# Altium schematic sheet Hack_Final.SchDoc
size A2; SheetNumber: 1; SheetTotal: 2
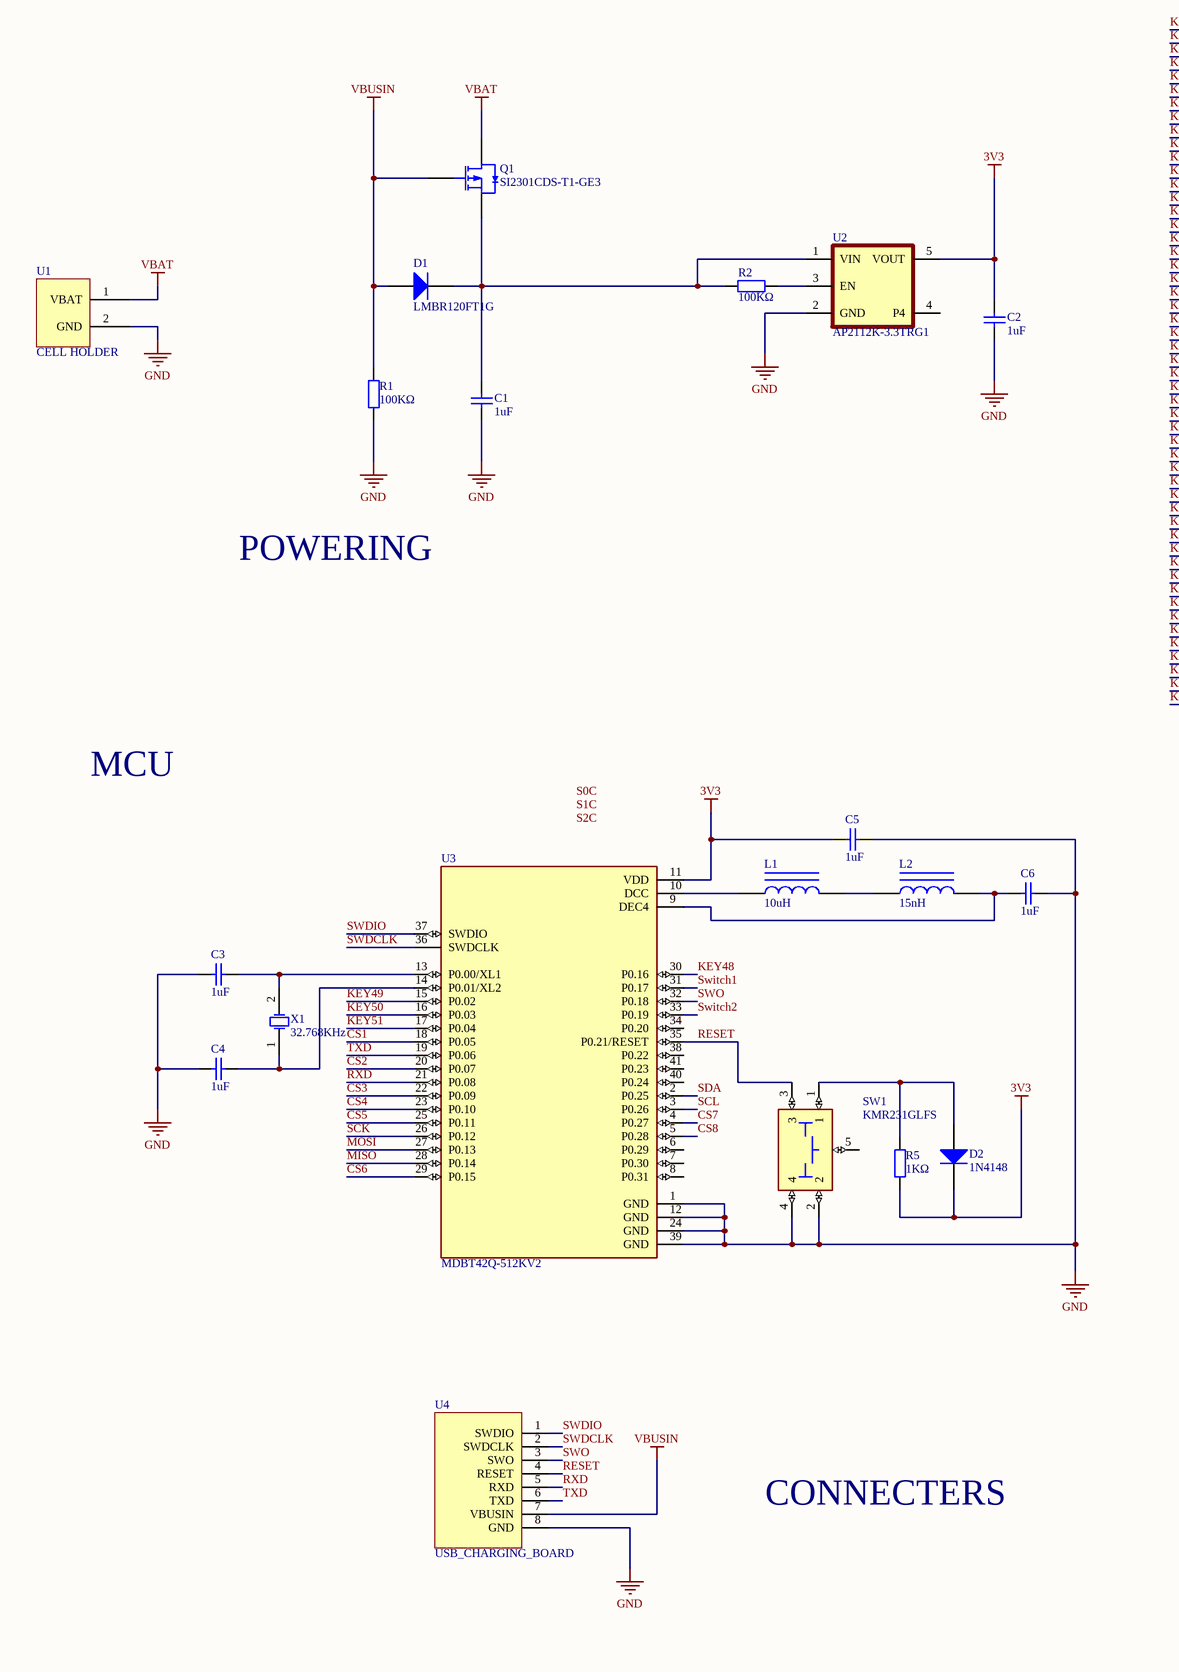
[diagram p0: Hack_Final.SchDoc, left]
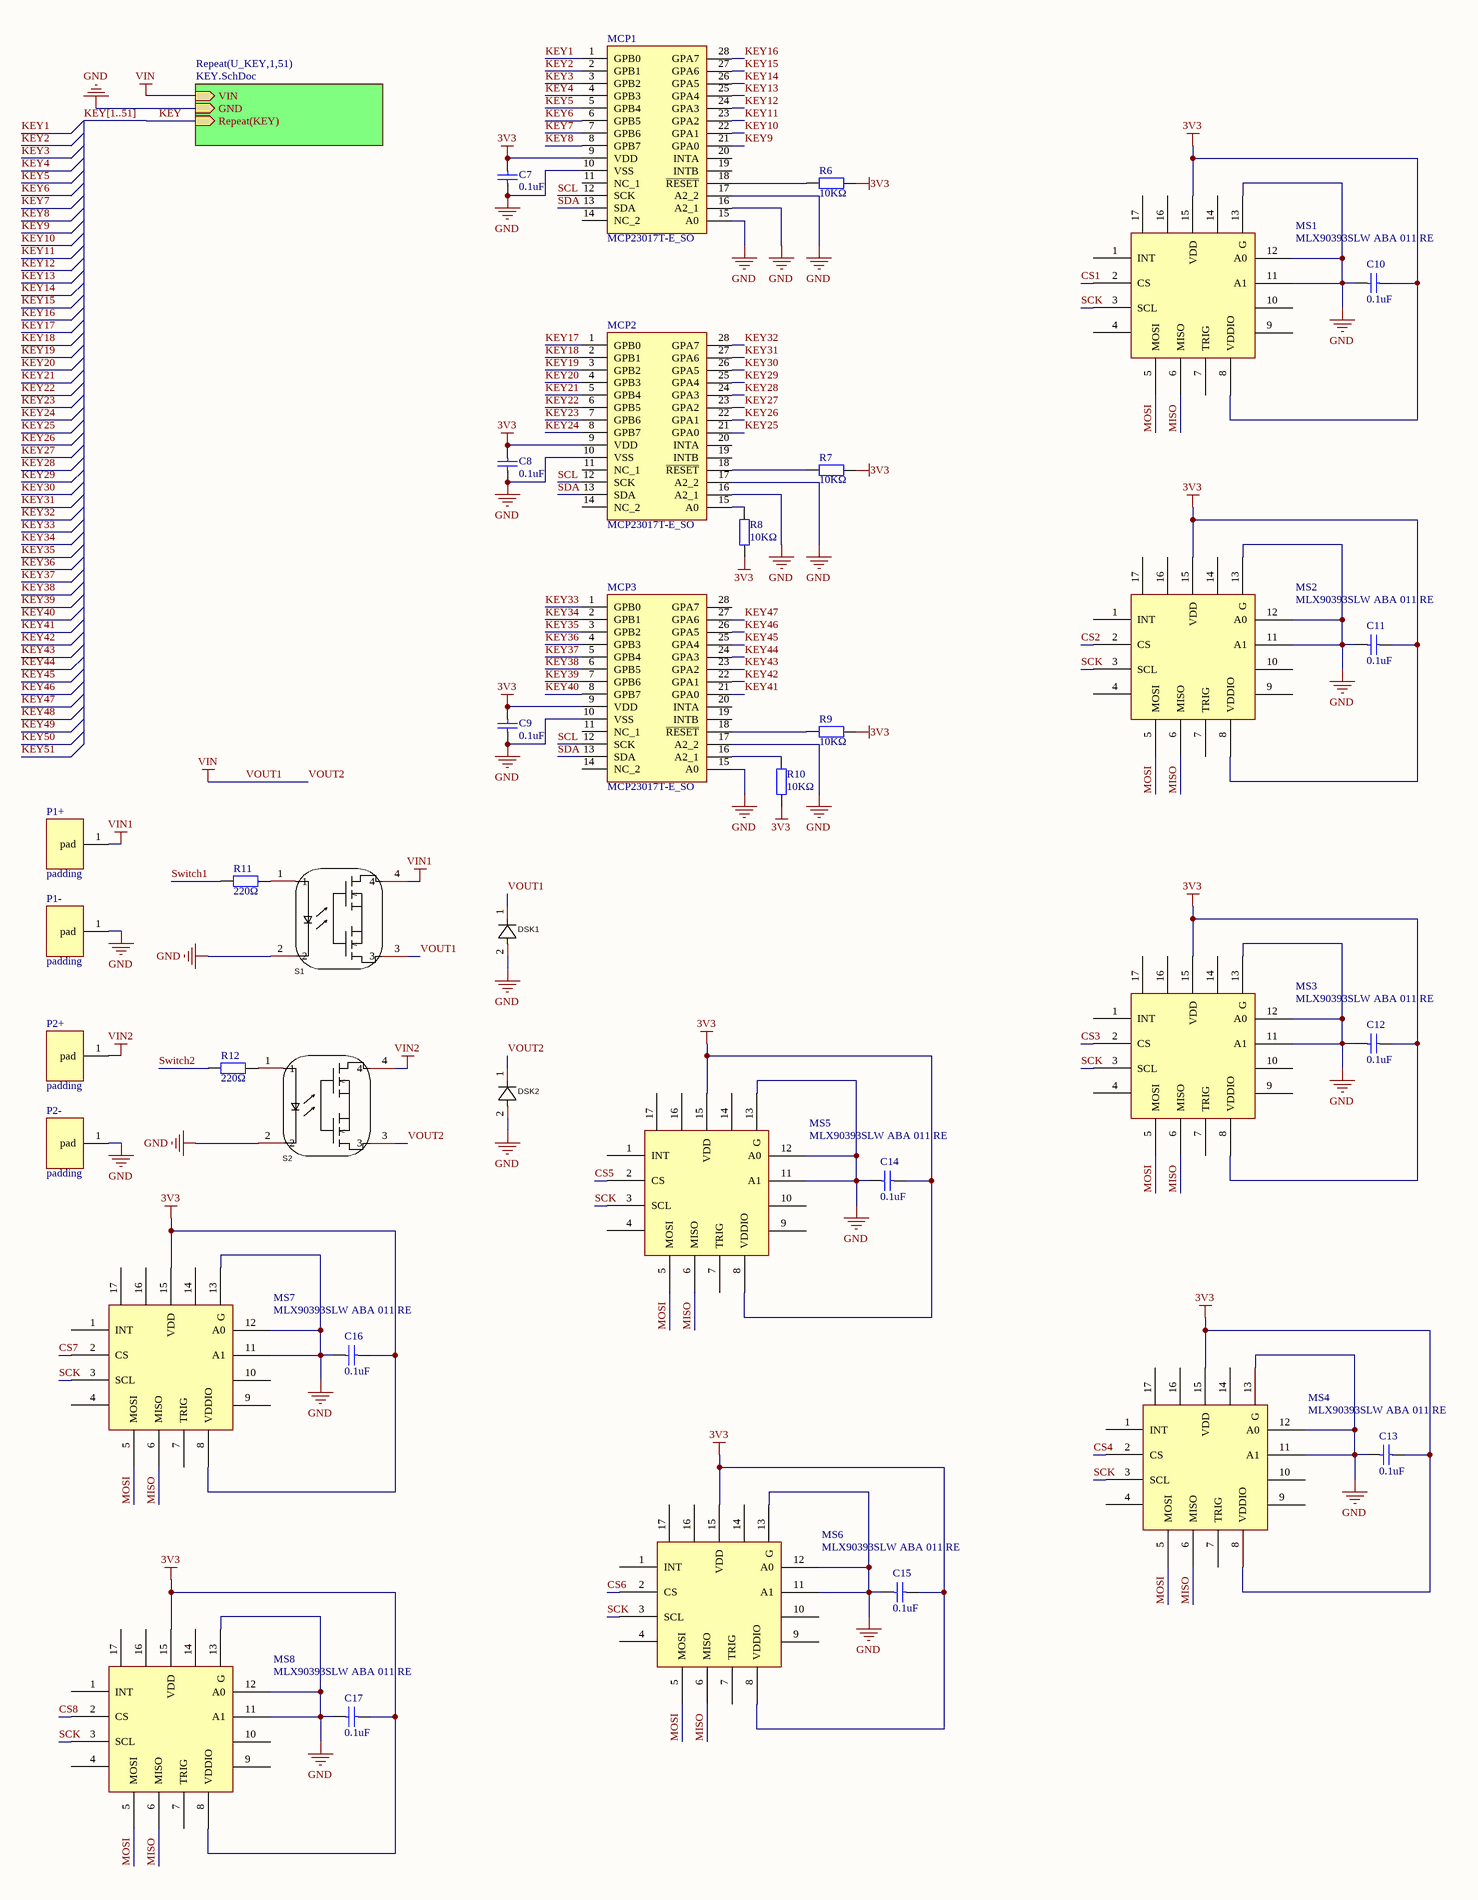
[diagram p1: Hack_Final.SchDoc, right]

## Parts
C1  1uF  [0603_C]
C2  1uF  [0603_C]
C3  1uF  [0603_C]
C4  1uF  [0603_C]
C5  1uF  [0603_C]
C6  1uF  [0603_C]
C7  0.1uF  [0603_C]
C8  0.1uF  [0603_C]
C9  0.1uF  [0603_C]
C10  0.1uF  [0603_C]
C11  0.1uF  [0603_C]
C12  0.1uF  [0603_C]
C13  0.1uF  [0603_C]
C14  0.1uF  [0603_C]
C15  0.1uF  [0603_C]
C16  0.1uF  [0603_C]
C17  0.1uF  [0603_C]
D1  LMBR120FT1G  [SOD-123]
D2  1N4148  [SOD-323F]
DSK1  DSK16  [DSK16]  (value not drawn)
DSK2  DSK16  [DSK16]  (value not drawn)
L1  10uH  [0402_L]
L2  15nH  [0402_L]
MCP1  MCP23017T-E_SO  [SOIC127P1030X265-28N]
MCP2  MCP23017T-E_SO  [SOIC127P1030X265-28N]
MCP3  MCP23017T-E_SO  [SOIC127P1030X265-28N]
MS1  MLX90393SLW ABA 011 RE  [VQFN-16_EP_3.0x3.0xo.5P]
MS2  MLX90393SLW ABA 011 RE  [VQFN-16_EP_3.0x3.0xo.5P]
MS3  MLX90393SLW ABA 011 RE  [VQFN-16_EP_3.0x3.0xo.5P]
MS4  MLX90393SLW ABA 011 RE  [VQFN-16_EP_3.0x3.0xo.5P]
MS5  MLX90393SLW ABA 011 RE  [VQFN-16_EP_3.0x3.0xo.5P]
MS6  MLX90393SLW ABA 011 RE  [VQFN-16_EP_3.0x3.0xo.5P]
MS7  MLX90393SLW ABA 011 RE  [VQFN-16_EP_3.0x3.0xo.5P]
MS8  MLX90393SLW ABA 011 RE  [VQFN-16_EP_3.0x3.0xo.5P]
P1+  padding  [PADDING2]
P1-  padding  [PADDING2]
P2+  padding  [PADDING2]
P2-  padding  [PADDING2]
Q1  SI2301CDS-T1-GE3  [SOT-23(SOT-23-3)]
R1  100KΩ  [0603_R]
R2  100KΩ  [0603_R]
R5  1KΩ  [0603_R]
R6  10KΩ  [0603_R]
R7  10KΩ  [0603_R]
R8  10KΩ  [0603_R]
R9  10KΩ  [0603_R]
R10  10KΩ  [0603_R]
R11  220Ω  [0603_R]
R12  220Ω  [0603_R]
S1  GAQY212GSX  [SOP-4_L4.3-W4.4-P2.54-LS6.8-TR]  (value not drawn)
S2  GAQY212GSX  [SOP-4_L4.3-W4.4-P2.54-LS6.8-TR]  (value not drawn)
SW1  KMR231GLFS  [KMR231GLFS]
U1  CELL HOLDER  [BAT_MX 1.25-WI-2P]
U2  AP2112K-3.3TRG1  [SOT95P285X140-5N]
U3  MDBT42Q-512KV2  [SMD_10.0X16.0]
U4  USB_CHARGING_BOARD  [FPC0.5 2H-WS-8P]
X1  32.768KHz  [SMD-3215_2P FC - 135]

## Sub-sheets
Repeat(U_KEY,1,51) = KEY.SchDoc: VIN (in), GND (in), Repeat(KEY) (in)

## Nets
3V3: C2.2 C5.2 C7.1 C8.1 C9.1 C10.2 C11.2 C12.2 C13.2 C14.2 C15.2 C16.2 C17.2 D2.2(K) MCP1.9(VDD) MCP2.9(VDD) MCP3.9(VDD) MS1.8(VDDIO) MS1.15(VDD) MS2.8(VDDIO) MS2.15(VDD) MS3.8(VDDIO) MS3.15(VDD) MS4.8(VDDIO) MS4.15(VDD) MS5.8(VDDIO) MS5.15(VDD) MS6.8(VDDIO) MS6.15(VDD) MS7.8(VDDIO) MS7.15(VDD) MS8.8(VDDIO) MS8.15(VDD) R5.2 R6.1 R7.1 R8.2 R9.1 R10.2 U2.5(VOUT) U3.11(VDD)
GND: C1.1 C2.1 C3.2 C4.2 C5.1 C6.1 C7.2 C8.2 C9.2 C10.1 C11.1 C12.1 C13.1 C14.1 C15.1 C16.1 C17.1 DSK1.2(A) DSK2.2(A) MCP1.10(VSS) MCP1.15(A0) MCP1.16(A2_1) MCP1.17(A2_2) MCP2.10(VSS) MCP2.16(A2_1) MCP2.17(A2_2) MCP3.10(VSS) MCP3.15(A0) MCP3.17(A2_2) MS1.11(A1) MS1.12(A0) MS1.13(G) MS2.11(A1) MS2.12(A0) MS2.13(G) MS3.11(A1) MS3.12(A0) MS3.13(G) MS4.11(A1) MS4.12(A0) MS4.13(G) MS5.11(A1) MS5.12(A0) MS5.13(G) MS6.11(A1) MS6.12(A0) MS6.13(G) MS7.11(A1) MS7.12(A0) MS7.13(G) MS8.11(A1) MS8.12(A0) MS8.13(G) P1-.1(pad) P2-.1(pad) R1.1 S1.2 S2.2 SW1.2 SW1.4 U1.2(GND) U2.2(GND) U3.1(GND) U3.12(GND) U3.24(GND) U3.39(GND) U4.8(GND) ; sheet Repeat(U_KEY,1,51)/GND
VBAT: Q1.3(D) U1.1(VBAT)
VBUSIN: D1.1(A) Q1.1(G) R1.2 U4.7(VBUSIN)
VIN1: P1+.1(pad) S1.4
VIN2: P2+.1(pad) S2.4
VOUT1: DSK1.1(K) DSK2.1(K) S1.3 S2.3 ; sheet Repeat(U_KEY,1,51)/VIN  [also labelled VIN, VOUT2]
CS1: MS1.2(CS) U3.18(P0.05)
CS2: MS2.2(CS) U3.20(P0.07)
CS3: MS3.2(CS) U3.22(P0.09)
CS4: MS4.2(CS) U3.23(P0.10)
CS5: MS5.2(CS) U3.25(P0.11)
CS6: MS6.2(CS) U3.29(P0.15)
CS7: MS7.2(CS) U3.4(P0.27)
CS8: MS8.2(CS) U3.5(P0.28)
KEY: sheet Repeat(U_KEY,1,51)/Repeat(KEY)
KEY1: MCP1.1(GPB0)
KEY2: MCP1.2(GPB1)
KEY3: MCP1.3(GPB2)
KEY4: MCP1.4(GPB3)
KEY5: MCP1.5(GPB4)
KEY6: MCP1.6(GPB5)
KEY7: MCP1.7(GPB6)
KEY8: MCP1.8(GPB7)
KEY9: MCP1.21(GPA0)
KEY10: MCP1.22(GPA1)
KEY11: MCP1.23(GPA2)
KEY12: MCP1.24(GPA3)
KEY13: MCP1.25(GPA4)
KEY14: MCP1.26(GPA5)
KEY15: MCP1.27(GPA6)
KEY16: MCP1.28(GPA7)
KEY17: MCP2.1(GPB0)
KEY18: MCP2.2(GPB1)
KEY19: MCP2.3(GPB2)
KEY20: MCP2.4(GPB3)
KEY21: MCP2.5(GPB4)
KEY22: MCP2.6(GPB5)
KEY23: MCP2.7(GPB6)
KEY24: MCP2.8(GPB7)
KEY25: MCP2.21(GPA0)
KEY26: MCP2.22(GPA1)
KEY27: MCP2.23(GPA2)
KEY28: MCP2.24(GPA3)
KEY29: MCP2.25(GPA4)
KEY30: MCP2.26(GPA5)
KEY31: MCP2.27(GPA6)
KEY32: MCP2.28(GPA7)
KEY33: MCP3.1(GPB0)
KEY34: MCP3.2(GPB1)
KEY35: MCP3.3(GPB2)
KEY36: MCP3.4(GPB3)
KEY37: MCP3.5(GPB4)
KEY38: MCP3.6(GPB5)
KEY39: MCP3.7(GPB6)
KEY40: MCP3.8(GPB7)
KEY41: MCP3.21(GPA0)
KEY42: MCP3.22(GPA1)
KEY43: MCP3.23(GPA2)
KEY44: MCP3.24(GPA3)
KEY45: MCP3.25(GPA4)
KEY46: MCP3.26(GPA5)
KEY47: MCP3.27(GPA6)
KEY48: U3.30(P0.16)
KEY49: U3.15(P0.02)
KEY50: U3.16(P0.03)
KEY51: U3.17(P0.04)
MISO: MS1.6(MISO) MS2.6(MISO) MS3.6(MISO) MS4.6(MISO) MS5.6(MISO) MS6.6(MISO) MS7.6(MISO) MS8.6(MISO) U3.28(P0.14)
MOSI: MS1.5(MOSI) MS2.5(MOSI) MS3.5(MOSI) MS4.5(MOSI) MS5.5(MOSI) MS6.5(MOSI) MS7.5(MOSI) MS8.5(MOSI) U3.27(P0.13)
RESET: SW1.3 U3.35(P0.21/RESET) U4.4(RESET)
RXD: U3.21(P0.08) U4.5(RXD)
SCK: MS1.3(SCL) MS2.3(SCL) MS3.3(SCL) MS4.3(SCL) MS5.3(SCL) MS6.3(SCL) MS7.3(SCL) MS8.3(SCL) U3.26(P0.12)
SCL: MCP1.12(SCK) MCP2.12(SCK) MCP3.12(SCK) U3.3(P0.26)
SDA: MCP1.13(SDA) MCP2.13(SDA) MCP3.13(SDA) U3.2(P0.25)
SWDCLK: U3.36(SWDCLK) U4.2(SWDCLK)
SWDIO: U3.37(SWDIO) U4.1(SWDIO)
Switch1: R11.1 U3.31(P0.17)
Switch2: R12.1 U3.33(P0.19)
SWO: U3.32(P0.18) U4.3(SWO)
TXD: U3.19(P0.06) U4.6(TXD)
NetC1_2: C1.2 D1.2(K) Q1.2(S) R2.2 U2.1(VIN)
NetC3_1: C3.1 U3.13(P0.00/XL1) X1.2(OSC2)
NetC4_1: C4.1 U3.14(P0.01/XL2) X1.1(OSC1)
NetC6_2: C6.2 L2.2 U3.9(DEC4)
NetD2_1: D2.1(A) R5.1 SW1.1
NetL1_1: L1.1 U3.10(DCC)
NetL1_2: L1.2 L2.1
NetMCP1_18: MCP1.18(~{RESET}) R6.2
NetMCP2_15: MCP2.15(A0) R8.1
NetMCP2_18: MCP2.18(~{RESET}) R7.2
NetMCP3_16: MCP3.16(A2_1) R10.1
NetMCP3_18: MCP3.18(~{RESET}) R9.2
NetR2_1: R2.1 U2.3(EN)
NetR11_2: R11.2 S1.1
NetR12_2: R12.2 S2.1

Not connected (* = marked no-connect by the designer): MCP1 11(NC_1) 14(NC_2) 19(INTB) 20(INTA); MCP2 11(NC_1) 14(NC_2) 19(INTB) 20(INTA); MCP3 11(NC_1) 14(NC_2) 19(INTB) 20(INTA) 28(GPA7); MS1 1(INT) 4 7(TRIG) 9 10 14 16 17; MS2 1(INT) 4 7(TRIG) 9 10 14 16 17; MS3 1(INT) 4 7(TRIG) 9 10 14 16 17; MS4 1(INT) 4 7(TRIG) 9 10 14 16 17; MS5 1(INT) 4 7(TRIG) 9 10 14 16 17; MS6 1(INT) 4 7(TRIG) 9 10 14 16 17; MS7 1(INT) 4 7(TRIG) 9 10 14 16 17; MS8 1(INT) 4 7(TRIG) 9 10 14 16 17; SW1 5; U2 4(P4); U3 6(P0.29) 7(P0.30) 8(P0.31) 34(P0.20) 38(P0.22) 40(P0.24) 41(P0.23)

## Buses and harness runs
bus KEY[1..51]

## Notes on the sheet
- POWERING
- MCU
- CONNECTERS
- Labels drawn without touching a wire or pin: S0C, S1C, S2C

## Library data of the parts
C1-C17 = CAP: capacitance; ComponentLink1Description: 供应商链接; ComponentLink1URL: http://www.szlcsc.com/product/details_16531.html; Package: 0603; Supplier: LC; SuppliersPartNumber: C15849
D1 = DIO_5: schottky diode; ComponentLink1Description: 供应商链接; ComponentLink1URL: http://www.szlcsc.com/product/details_9093.html; Package: SOD-123; Supplier: LC; SuppliersPartNumber: C8598
D2 = DIO_4: diode; ComponentLink1Description: 供应商链接; ComponentLink1URL: http://www.szlcsc.com/product/details_2485.html; Package: SOD-323; Supplier: LC; SuppliersPartNumber: C2128
DSK1 DSK2 = DSK16: Manufacturer: HXY MOSFET(华轩阳电子); Symbol: DSK16_C20611954; Add into BOM: yes; Diode Configuration: 独立式; Forward Voltage (Vf@If): 700mV@1A; Reverse Voltage (Vr): 60V; Average Rectified Current (Io): 1A; Name: DSK16; Device: DSK16_C20611954; LCSC Part Name: 电压:60V 电流:1A; Supplier Part: C20611954; Manufacturer Part: DSK16; Supplier Footprint: SOD-123FL; JLCPCB Part Class: Extended Part; Datasheet: https://atta.szlcsc.com/upload/public/pdf/source/20240126/50FF75CDB1A7B4BD07BEF0250A341C5F.pdf; Supplier: LCSC; Convert to PCB: yes; Reverse Leakage Current (Ir): -
L1 = IND_10uH: inductance; ComponentLink1Description: 供应商链接; ComponentLink1URL: http://www.szlcsc.com/product/details_1398.html; Package: 0805; Supplier: LC; SuppliersPartNumber: C1046
L2 = IND_15nH: inductance; ComponentLink1Description: 供应商链接; ComponentLink1URL: http://www.szlcsc.com/product/details_1398.html; Package: 0805; Supplier: LC; SuppliersPartNumber: C1046
MCP1-MCP3 = MCP23017T-E_SO: Integrated Circuit; Manufacturer_Name: Microchip; Manufacturer_Part_Number: MCP23017T-E/SO; Datasheet Link: http://ww1.microchip.com/downloads/en/DeviceDoc/20001952C.pdf; Height: 2.65mm; Mouser Part Number: 579-MCP23017T-E/SO; Mouser Price/Stock: https://www.mouser.co.uk/ProductDetail/Microchip-Technology/MCP23017T-E-SO?qs=usxtMOJb1RylPfT%252BJtgE3Q%3D%3D; Arrow Part Number: MCP23017T-E/SO; Arrow Price/Stock: https://www.arrow.com/en/products/mcp23017t-eso/microchip-technology?region=nac
MS1-MS8 = MLX90393SLW ABA 011 RE: sensor
P1+ P1- P2+ P2- = padding2
Q1 = MOS: field effect tube; ComponentLink1Description: 供应商链接; ComponentLink1URL: http://www.szlcsc.com/product/details_11030.html; Package: SOT-23(SOT-23-3); Supplier: LC; SuppliersPartNumber: C10487
R1 R2 R5-R12 = RES: resistance; ComponentLink1Description: 供应商链接; ComponentLink1URL: http://www.szlcsc.com/product/details_26562.html; Package: 0603; Supplier: LC; SuppliersPartNumber: C25819
S1 S2 = GAQY212GSX: Manufacturer: SUPSiC(国晶微半导体); Add into BOM: yes; Relay Contact Form: 1 Form A (SPST-NO); Load Type: AC,DC; Input Forward Voltage: 1.32V; Voltage - Load: 60V; Continuous Load Current: 1A; On Resistance: 180mΩ; Isolation Voltage(rms): 1.5kV; Turn-on time: 350us; Turn-off time: 100us; Name: GAQY212GSX; Symbol: GAQY212GSX; Device: GAQY212GSX; LCSC Part Name: 固态继电器; Supplier Part: C19271988; Manufacturer Part: GAQY212GSX; Supplier Footprint: SOP-4; JLCPCB Part Class: Extended Part; Datasheet: https://atta.szlcsc.com/upload/public/pdf/source/20231201/71CDF33FACEA97DA9648A52C46D9B1CB.pdf; Supplier: LCSC; Convert to PCB: yes
SW1 = KMR231GLFS: Tactile Switch SPST-NO Top Actuated Surface Mount
U1 = BAT: button cell battary holder BS-08-B2AA025
U2 = AP2112K: LDO_ low dropout linear regulator
U3 = MDBT42Q-512KV2: RAYTAC  MDBT42Q-512KV2 Bluetooth Low Energy Module https://www.raytac.com/product/ins.php?index_id=31 https://www.snapeda.com/parts/MDBT42Q-512KV2/Raytac%20Corporation/view-part/?ref=search&t=MDBT42Q-512KV2
X1 = ABS07-32.768KHZ-7-T: crystal; ComponentLink1Description: 供应商链接; ComponentLink1URL: http://www.szlcsc.com/product/details_33310.html; Package: SMD-3215_2P; Supplier: LC; SuppliersPartNumber: C32346